# Altium project jaroo_fuck_navid_gun_xc_1.0.PrjPcb
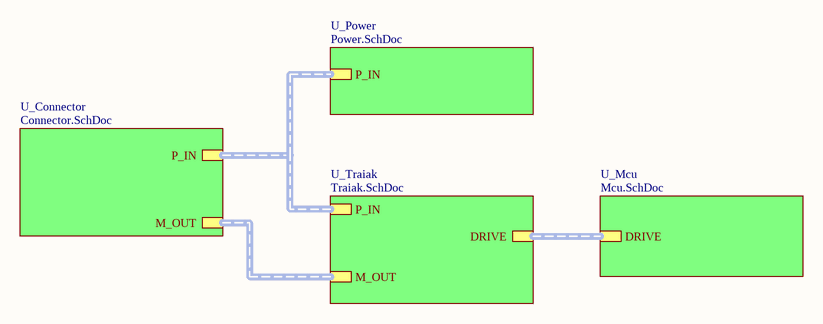
[diagram p0: Multy_sheet.SchDoc]
6 sheets, 47 parts. Net scope: hierarchical (ports join the sheet entries above them; power ports are global).
Board file: jaroo_fuck_navid_gun_xc_1.0.PcbDoc
Sheets:
  Multy_sheet.SchDoc
    U_Connector = Connector.SchDoc
    U_Mcu = Mcu.SchDoc
      U_Capacitive_touch = Capacitive_touch.SchDoc
    U_Power = Power.SchDoc
    U_Traiak = Traiak.SchDoc

## Sheet Multy_sheet.SchDoc
size A4

### Sub-sheets
U_Connector = Connector.SchDoc: P_IN (harness P_IN), M_OUT (harness M_OUT)
U_Mcu = Mcu.SchDoc: DRIVE (harness DRIVE)
U_Power = Power.SchDoc: P_IN (harness P_IN)
U_Traiak = Traiak.SchDoc: P_IN (harness P_IN), M_OUT (harness M_OUT), DRIVE (harness DRIVE)

### Buses and harness runs
harness sheet U_Connector/M_OUT = sheet U_Traiak/M_OUT
harness sheet U_Connector/P_IN = sheet U_Power/P_IN = sheet U_Traiak/P_IN
harness sheet U_Mcu/DRIVE = sheet U_Traiak/DRIVE

### Notes on the sheet
- Title
- Size:
- Date:
- A3
- Number:
- Time:
- Revision:
- Sheet
- of
- File:

## Sheet Connector.SchDoc
size 177 x 114 mm
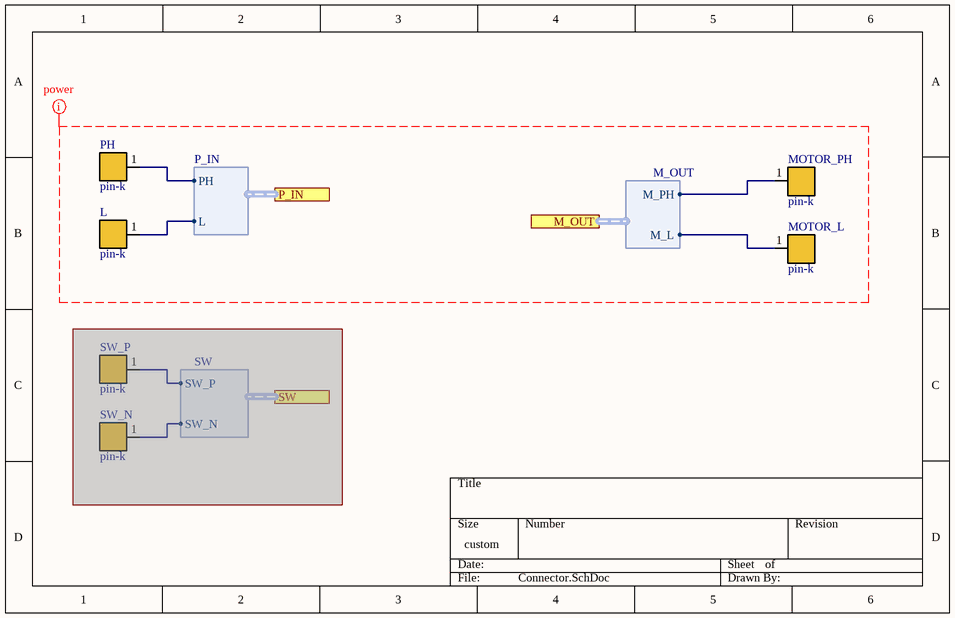
[diagram p1: Connector.SchDoc]

### Parts
L  pin-k  [pin_k]
MOTOR_L  pin-k  [pin_k]
MOTOR_PH  pin-k  [pin_k]
PH  pin-k  [pin_k]
SW_N  pin-k  [pin_k]  (masked out: inside a compile mask, not in the netlist)
SW_P  pin-k  [pin_k]  (masked out: inside a compile mask, not in the netlist)

### Ports
M_OUT (harness M_OUT), P_IN (harness P_IN), SW (harness SW)

### Harnesses
P_IN: PH, L
M_OUT: M_L, M_PH
SW: SW_P, SW_N

### Nets
+5: PH.1 ; port P_IN.PH
L: L.1 MOTOR_L.1 ; port P_IN.L, port M_OUT.M_L
NetC7_2: MOTOR_PH.1 ; port M_OUT.M_PH

### Layout directives
net class power: (no net found under the mark)

## Sheet Mcu.SchDoc
size A
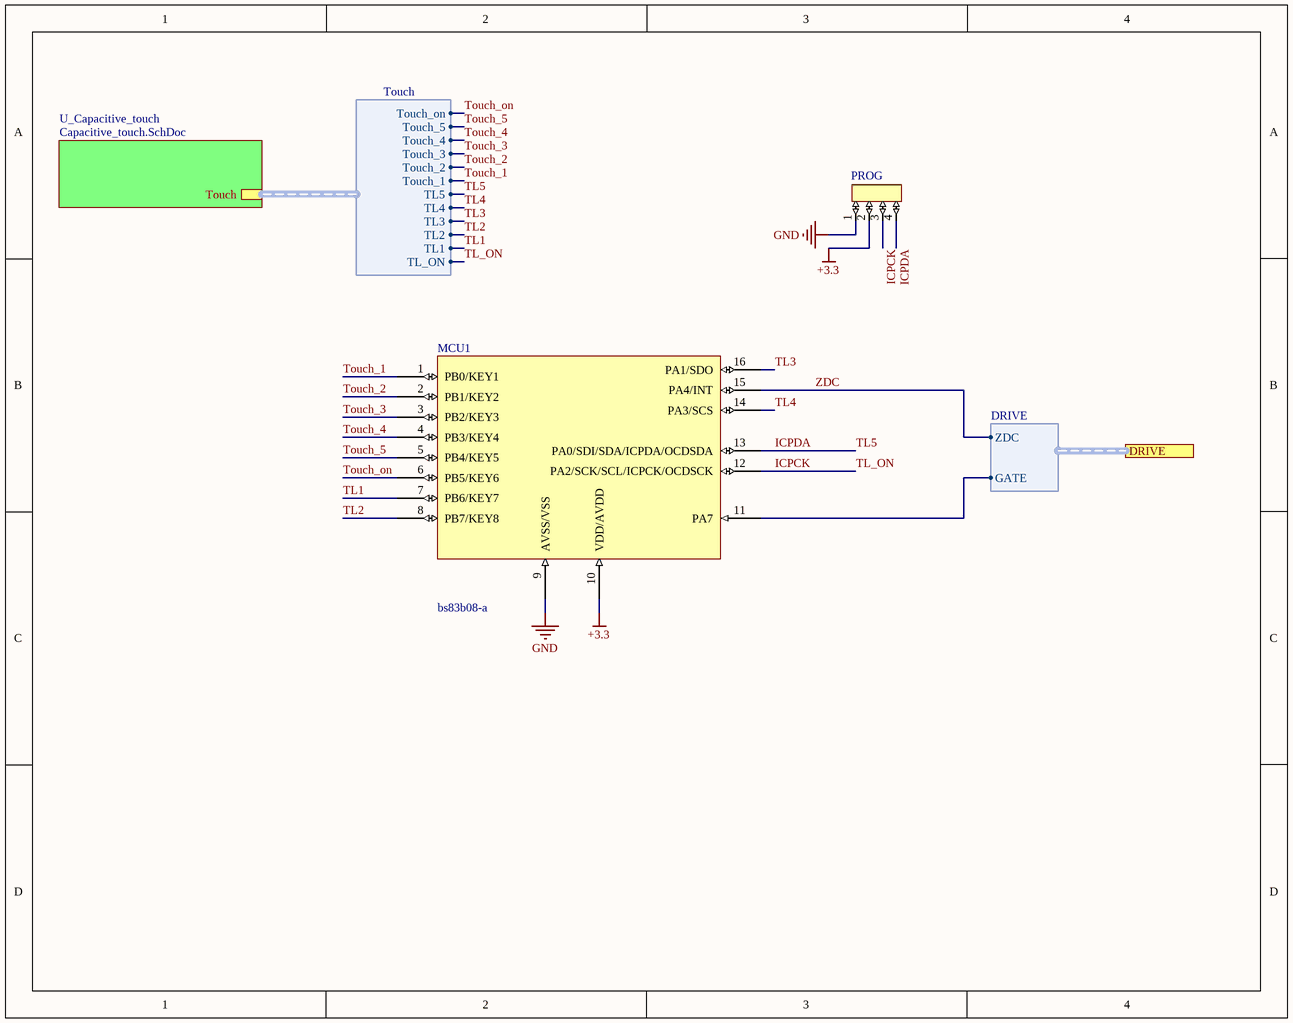
[diagram p2: Mcu.SchDoc]

### Parts
MCU1  bs83b08-a  [bs83b08-a]
PROG  (no value)  [CONECTOR/XH/4PIN]

### Sub-sheets
U_Capacitive_touch = Capacitive_touch.SchDoc: Touch (harness Touch)

### Ports
DRIVE (harness DRIVE)

### Harnesses
Touch: TL_ON, TL1, TL2, TL3, TL4, TL5, Touch_1, Touch_2, Touch_3, Touch_4, Touch_5, Touch_on
DRIVE: GATE, ZDC

### Nets
+3.3: MCU1.10(VDD/AVDD) PROG.2
GND: MCU1.9(AVSS/VSS) PROG.1
ICPCK: MCU1.12(PA2/SCK/SCL/ICPCK/OCDSCK) PROG.3 ; sheet U_Capacitive_touch/Touch.TL_ON  [also labelled TL_ON]
ICPDA: MCU1.13(PA0/SDI/SDA/ICPDA/OCDSDA) PROG.4 ; sheet U_Capacitive_touch/Touch.TL5  [also labelled TL5]
TL1: MCU1.7(PB6/KEY7) ; sheet U_Capacitive_touch/Touch.TL1
TL2: MCU1.8(PB7/KEY8) ; sheet U_Capacitive_touch/Touch.TL2
TL3: MCU1.16(PA1/SDO) ; sheet U_Capacitive_touch/Touch.TL3
TL4: MCU1.14(PA3/SCS) ; sheet U_Capacitive_touch/Touch.TL4
Touch_1: MCU1.1(PB0/KEY1) ; sheet U_Capacitive_touch/Touch.Touch_1
Touch_2: MCU1.2(PB1/KEY2) ; sheet U_Capacitive_touch/Touch.Touch_2
Touch_3: MCU1.3(PB2/KEY3) ; sheet U_Capacitive_touch/Touch.Touch_3
Touch_4: MCU1.4(PB3/KEY4) ; sheet U_Capacitive_touch/Touch.Touch_4
Touch_5: MCU1.5(PB4/KEY5) ; sheet U_Capacitive_touch/Touch.Touch_5
Touch_on: MCU1.6(PB5/KEY6) ; sheet U_Capacitive_touch/Touch.Touch_on
ZDC: MCU1.15(PA4/INT) ; port DRIVE.ZDC
NetMCU1_11: MCU1.11(PA7) ; port DRIVE.GATE

### Library data of the parts
PROG = CONECTOR/XH/4PIN

## Sheet Capacitive_touch.SchDoc
size 381 x 228 mm; SheetNumber: 4; SheetTotal: 8
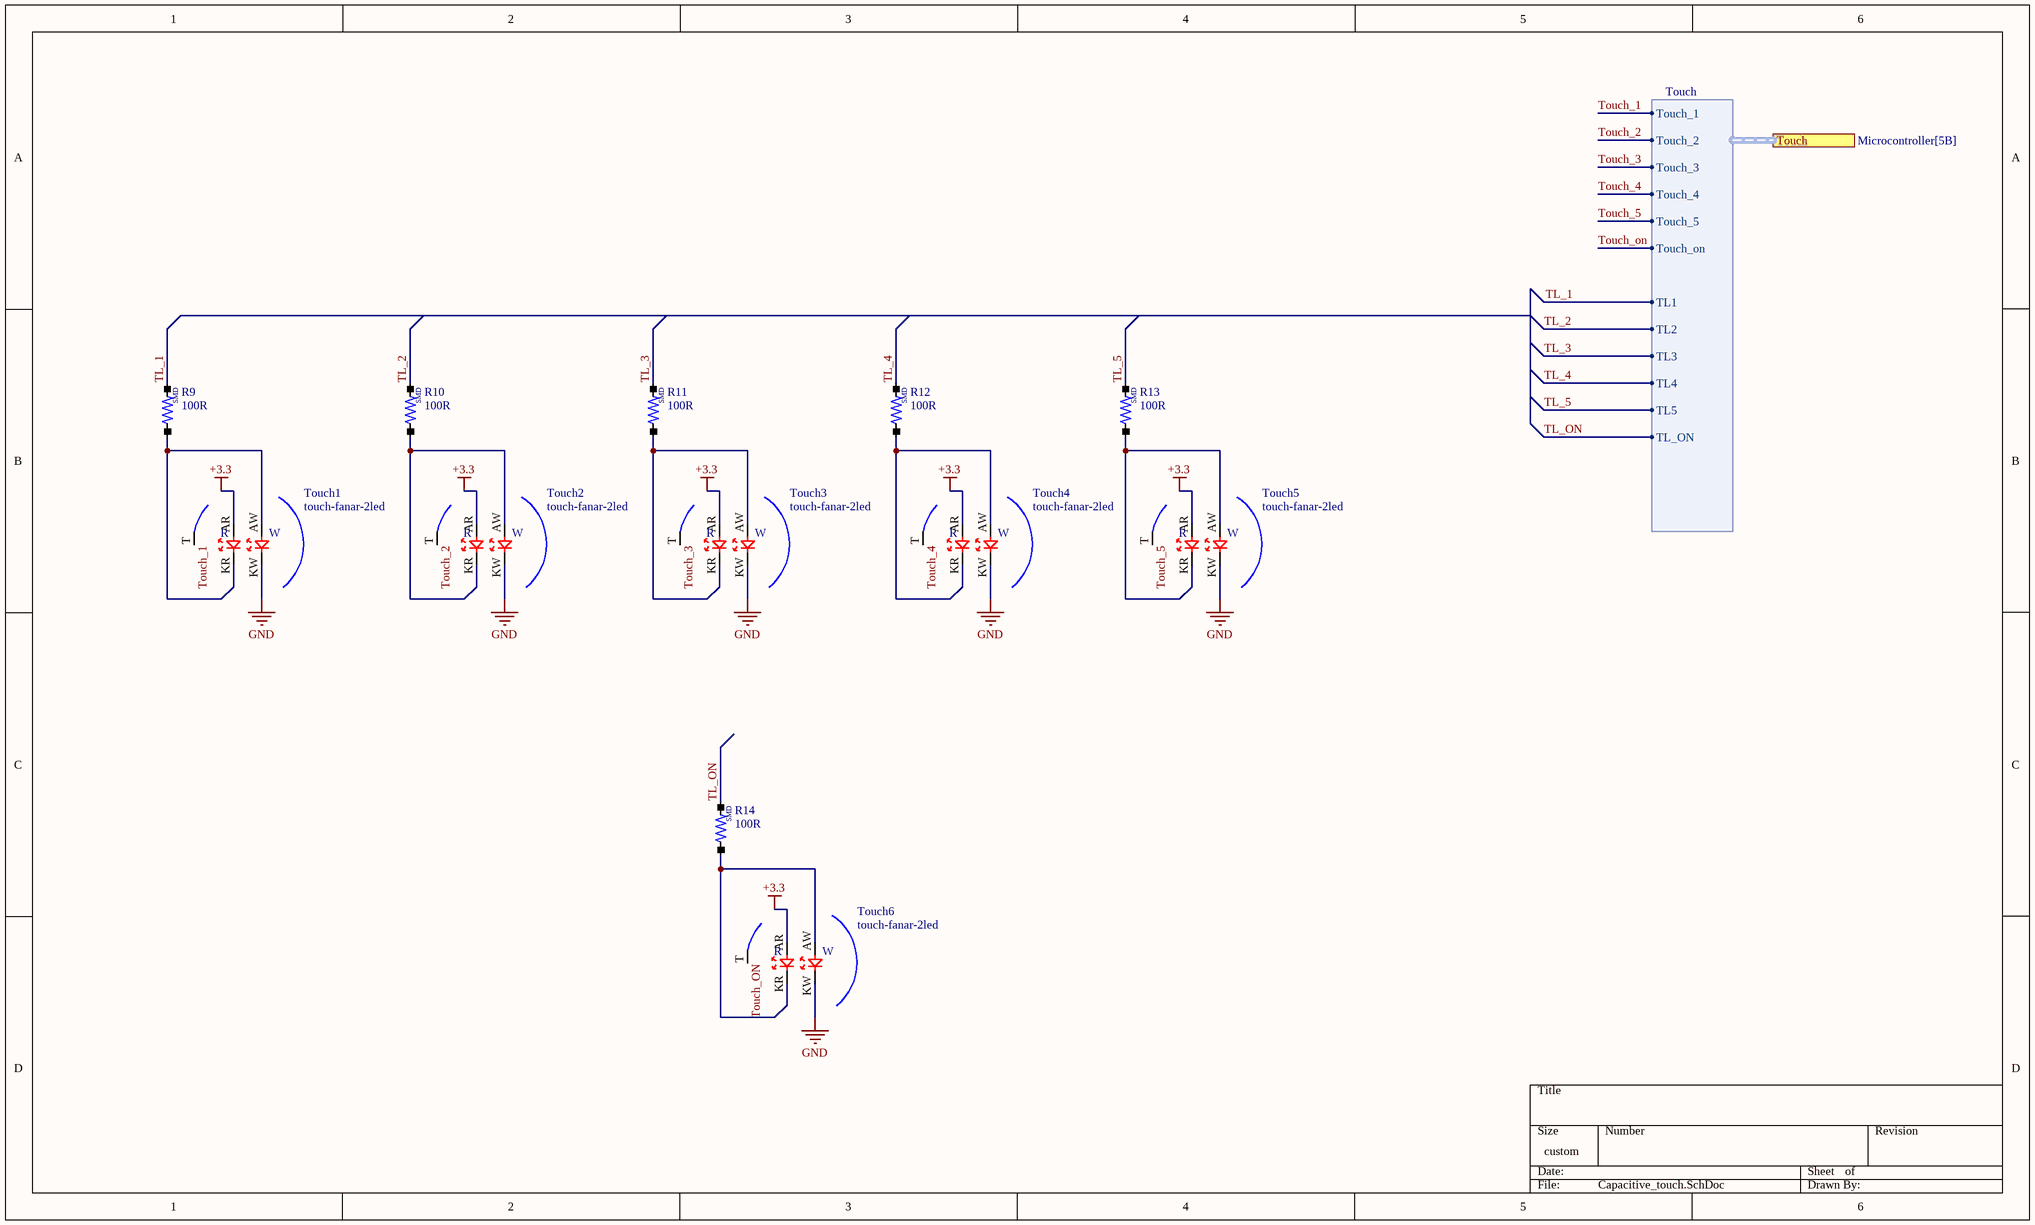
[diagram p3: Capacitive_touch.SchDoc]

### Parts
R9  100R  [RES/0603]
R10  100R  [RES/0603]
R11  100R  [RES/0603]
R12  100R  [RES/0603]
R13  100R  [RES/0603]
R14  100R  [RES/0603]
Touch1  touch-fanar-2led  [fanar-touch-2led]
Touch2  touch-fanar-2led  [fanar-touch-2led]
Touch3  touch-fanar-2led  [fanar-touch-2led]
Touch4  touch-fanar-2led  [fanar-touch-2led]
Touch5  touch-fanar-2led  [fanar-touch-2led]
Touch6  touch-fanar-2led  [fanar-touch-2led]

### Ports
Touch (harness Touch, see Microcontroller[5B])

### Harnesses
Touch: Touch_1, Touch_2, Touch_3, Touch_4, Touch_5, Touch_on, TL1, TL2, TL3, TL4, TL5, TL_ON

### Nets
+3.3: Touch1.AR Touch2.AR Touch3.AR Touch4.AR Touch5.AR Touch6.AR
GND: Touch1.KW Touch2.KW Touch3.KW Touch4.KW Touch5.KW Touch6.KW
TL_1: R9.2 ; port Touch.TL1  [project net TL1]
TL_2: R10.2 ; port Touch.TL2  [project net TL2]
TL_3: R11.2 ; port Touch.TL3  [project net TL3]
TL_4: R12.2 ; port Touch.TL4  [project net TL4]
TL_5: R13.2 ; port Touch.TL5  [project net ICPDA]
TL_ON: R14.2 ; port Touch.TL_ON  [project net ICPCK]
Touch_1: Touch1.T ; port Touch.Touch_1
Touch_2: Touch2.T ; port Touch.Touch_2
Touch_3: Touch3.T ; port Touch.Touch_3
Touch_4: Touch4.T ; port Touch.Touch_4
Touch_5: Touch5.T ; port Touch.Touch_5
Touch_on: Touch6.T ; port Touch.Touch_on
NetR9_1: R9.1 Touch1.AW Touch1.KR
NetR10_1: R10.1 Touch2.AW Touch2.KR
NetR11_1: R11.1 Touch3.AW Touch3.KR
NetR12_1: R12.1 Touch4.AW Touch4.KR
NetR13_1: R13.1 Touch5.AW Touch5.KR
NetR14_1: R14.1 Touch6.AW Touch6.KR

### Notes on the sheet
- (in symbol RES/SMD) SMD
- (in symbol touch-fanar-2led) R; W

### Library data of the parts
R9-R14 = RES/SMD

## Sheet Power.SchDoc
size A
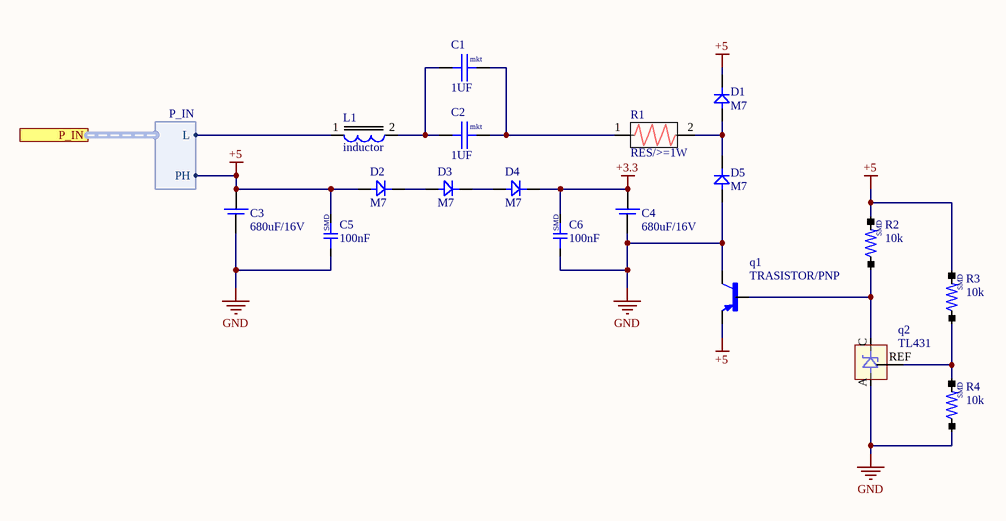
[diagram p4: Power.SchDoc]

### Parts
C1  1UF  [CAP/0.22uF/275v/mkt]
C2  1UF  [CAP/0.22uF/275v/mkt]
C3  680uF/16V  [cap/330u/16v]
C4  680uF/16V  [cap/330u/16v]
C5  100nF  [CAP-0805]
C6  100nF  [CAP-0805]
D1  M7  [DIOD/1N4007/SMD]
D2  M7  [DIOD/1N4007/SMD]
D3  M7  [DIOD/1N4007/SMD]
D4  M7  [DIOD/1N4007/SMD]
D5  M7  [DIOD/1N4007/SMD]
L1  inductor  [inductor-9*12]
q1  TRASISTOR/PNP  [BC557]
q2  TL431  [TL431]
R1  RES/>=1W  [RES/1W]
R2  10k  [RES/0805]
R3  10k  [RES/0805]
R4  10k  [RES/0805]

### Ports
P_IN (harness P_IN)

### Harnesses
P_IN: L, PH

### Nets
+3.3: C4.+ C6.2 D4.K
+5: C3.+ C5.2 D1.K D2.A q1.E R2.2 R3.2 ; port P_IN.PH
GND: C3.- C4.- C5.1 C6.1 D5.A q1.C q2.A R4.1
L: L1.1 ; port P_IN.L
NetC1_1: C1.1 C2.1 L1.2
NetC1_2: C1.2 C2.2 R1.1
NetD1_A: D1.A D5.K R1.2
NetD2_K: D2.K D3.A
NetD3_K: D3.K D4.A
Netq1_B: q1.B q2.C R2.1
Netq2_REF: q2.REF R3.1 R4.2

### Notes on the sheet
- (in symbol cap-mkt) mkt
- (in symbol cap_smd) SMD
- (in symbol RES/SMD) SMD

### Library data of the parts
C1 C2 = cap-mkt
C3 C4 = cap-electrolit
C5 C6 = cap_smd
D1-D5 = DIOD/RECTIFIERS
R2-R4 = RES/SMD

## Sheet Traiak.SchDoc
size A
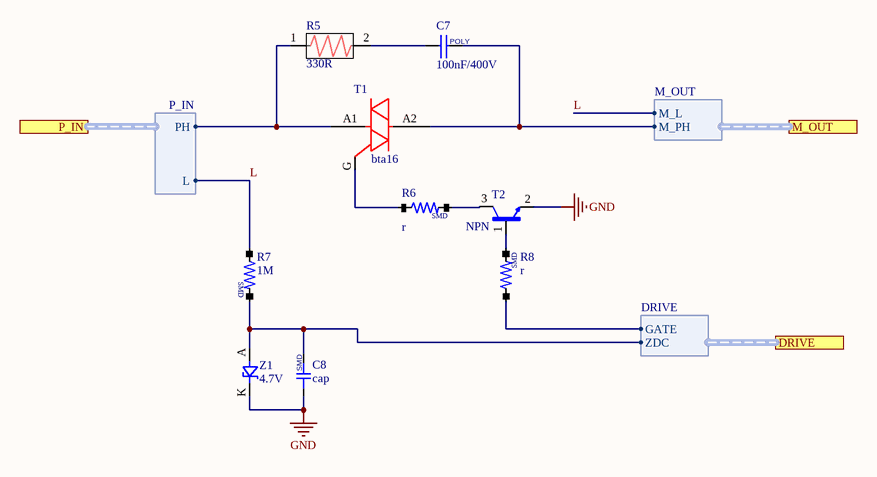
[diagram p5: Traiak.SchDoc]

### Parts
C7  100nF/400V  [CAP/100nF/275V/poly]
C8  cap  [CAP-0805]
R5  330R  [RES/1W]
R6  r  [RES/0805]
R7  1M  [RES/0805]
R8  r  [RES/0805]
T1  bta16  [bta16]
T2  NPN  [SOT23]
Z1  4.7V  [DIOD/RS1J]

### Ports
DRIVE (harness DRIVE), M_OUT (harness M_OUT), P_IN (harness P_IN)

### Harnesses
P_IN: L, PH
M_OUT: M_L, M_PH
DRIVE: GATE, ZDC

### Nets
+5: R5.1 T1.A1 ; port P_IN.PH
GND: C8.1 T2.2(E) Z1.K
L: R7.1 ; port P_IN.L, port M_OUT.M_L
ZDC: C8.2 R7.2 Z1.A ; port DRIVE.ZDC
NetC7_1: C7.1 R5.2
NetC7_2: C7.2 T1.A2 ; port M_OUT.M_PH
NetMCU1_11: R8.1 ; port DRIVE.GATE
NetR6_1: R6.1 T1.G
NetR6_2: R6.2 T2.3(C)
NetR8_2: R8.2 T2.1(B)

### Notes on the sheet
- (in symbol cap-poly) POLY
- (in symbol cap_smd) SMD
- (in symbol RES/SMD) SMD

### Library data of the parts
C7 = cap-poly
C8 = cap_smd
R5 = RES/>=1W
R6-R8 = RES/SMD
Z1 = zener-0.5w

## Nets that join several sheets
+3.3: Mcu (MCU1.10 PROG.2), Capacitive_touch (6 pins), Power (C4.+ C6.2 D4.K)
+5: Connector (PH.1), Power (7 pins), Traiak (R5.1 T1.A1)
GND: Mcu (MCU1.9 PROG.1), Capacitive_touch (6 pins), Power (8 pins), Traiak (C8.1 T2.2 Z1.K)
ICPCK: Mcu (MCU1.12 PROG.3), Capacitive_touch (R14.2)
ICPDA: Mcu (MCU1.13 PROG.4), Capacitive_touch (R13.2)
L: Connector (L.1 MOTOR_L.1), Power (L1.1), Traiak (R7.1)
NetC7_2: Connector (MOTOR_PH.1), Traiak (C7.2 T1.A2)
NetMCU1_11: Mcu (MCU1.11), Traiak (R8.1)
TL1: Mcu (MCU1.7), Capacitive_touch (R9.2)
TL2: Mcu (MCU1.8), Capacitive_touch (R10.2)
TL3: Mcu (MCU1.16), Capacitive_touch (R11.2)
TL4: Mcu (MCU1.14), Capacitive_touch (R12.2)
Touch_1: Mcu (MCU1.1), Capacitive_touch (Touch1.T)
Touch_2: Mcu (MCU1.2), Capacitive_touch (Touch2.T)
Touch_3: Mcu (MCU1.3), Capacitive_touch (Touch3.T)
Touch_4: Mcu (MCU1.4), Capacitive_touch (Touch4.T)
Touch_5: Mcu (MCU1.5), Capacitive_touch (Touch5.T)
Touch_on: Mcu (MCU1.6), Capacitive_touch (Touch6.T)
ZDC: Mcu (MCU1.15), Traiak (C8.2 R7.2 Z1.A)